# Altium project LVBackplane.PrjPcb
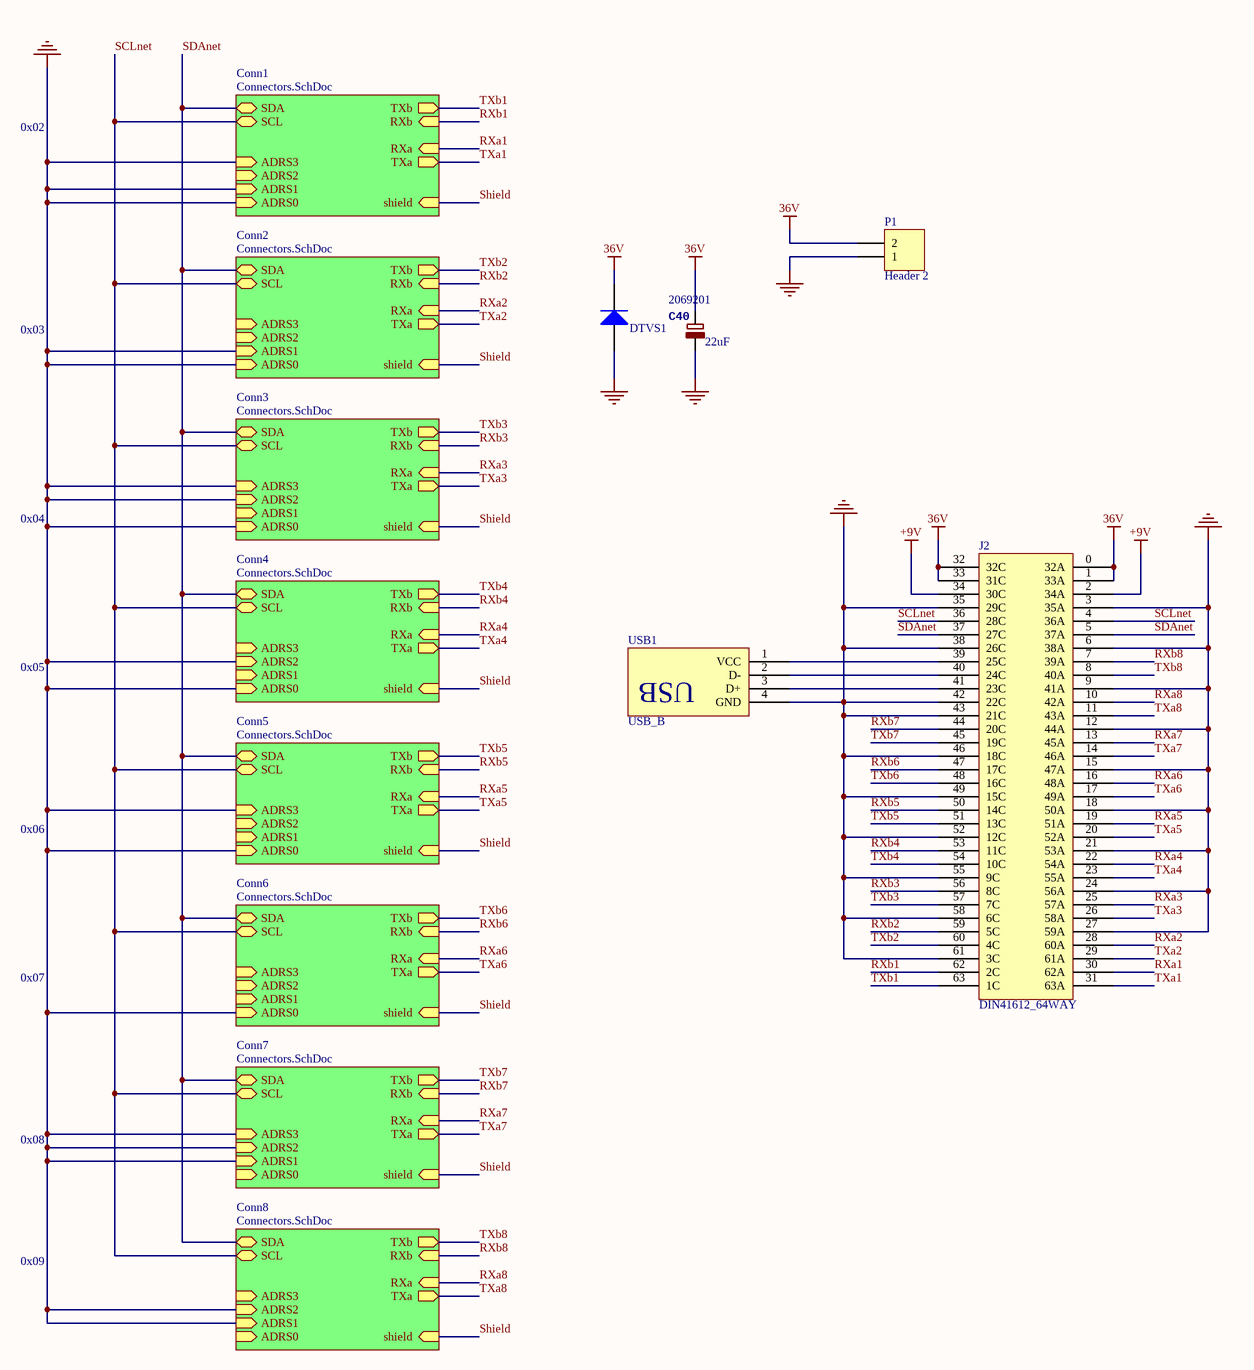
[diagram p0: Backplane.SchDoc]
2 sheets, 45 parts. Net scope: hierarchical (ports join the sheet entries above them; power ports are global).
Board files: 6C-2L-1550um.PcbDoc, Backplane.PcbDoc
Sheets:
  Backplane.SchDoc
    Conn1 = Connectors.SchDoc
    Conn2 = Connectors.SchDoc
    Conn3 = Connectors.SchDoc
    Conn4 = Connectors.SchDoc
    Conn5 = Connectors.SchDoc
    Conn6 = Connectors.SchDoc
    Conn7 = Connectors.SchDoc
    Conn8 = Connectors.SchDoc

## Sheet Backplane.SchDoc
size A3

### Parts
C40  value 22uF  Supplier Part Number 1: 2069201  [PANASONIC_D]
DTVS1  SMBJ36A  [SMBJ]  (value not drawn)
J2  DIN41612_64WAY  [09 03 164 6919]
P1  Header 2  [8PCV]
USB1  USB_B  [USB_B_VERTICAL]

### Sub-sheets
Conn1 = Connectors.SchDoc: SDA (bidir), SCL (bidir), RXb (in), TXb (out), RXa (in), TXa (out), ADRS3 (in), ADRS2 (in), ADRS1 (in), ADRS0 (in), shield (in)
Conn2 = Connectors.SchDoc: SDA (bidir), SCL (bidir), RXb (in), TXb (out), RXa (in), TXa (out), ADRS3 (in), ADRS2 (in), ADRS1 (in), ADRS0 (in), shield (in)
Conn3 = Connectors.SchDoc: SDA (bidir), SCL (bidir), RXb (in), TXb (out), RXa (in), TXa (out), ADRS3 (in), ADRS2 (in), ADRS1 (in), ADRS0 (in), shield (in)
Conn4 = Connectors.SchDoc: SDA (bidir), SCL (bidir), RXb (in), TXb (out), RXa (in), TXa (out), ADRS3 (in), ADRS2 (in), ADRS1 (in), ADRS0 (in), shield (in)
Conn5 = Connectors.SchDoc: SDA (bidir), SCL (bidir), RXb (in), TXb (out), RXa (in), TXa (out), ADRS3 (in), ADRS2 (in), ADRS1 (in), ADRS0 (in), shield (in)
Conn6 = Connectors.SchDoc: SDA (bidir), SCL (bidir), RXb (in), TXb (out), RXa (in), TXa (out), ADRS3 (in), ADRS2 (in), ADRS1 (in), ADRS0 (in), shield (in)
Conn7 = Connectors.SchDoc: SDA (bidir), SCL (bidir), RXb (in), TXb (out), RXa (in), TXa (out), ADRS3 (in), ADRS2 (in), ADRS1 (in), ADRS0 (in), shield (in)
Conn8 = Connectors.SchDoc: SDA (bidir), SCL (bidir), RXb (in), TXb (out), RXa (in), TXa (out), ADRS3 (in), ADRS2 (in), ADRS1 (in), ADRS0 (in), shield (in)

### Nets
36V: C40.1 DTVS1.1(K) J2.0(32A) J2.1(33A) J2.32(32C) J2.33(31C) P1.2
+9V: J2.2(34A) J2.34(30C)
GND: C40.2 DTVS1.2(A) J2.3(35A) J2.6(38A) J2.9(41A) J2.12(44A) J2.15(47A) J2.18(50A) J2.21(53A) J2.24(56A) J2.27(59A) J2.35(29C) J2.38(26C) J2.42(22C) J2.43(21C) J2.46(18C) J2.49(15C) J2.52(12C) J2.55(9C) J2.58(6C) J2.61(3C) P1.1 USB1.4(GND) ; sheet Conn1/ADRS3, sheet Conn1/ADRS1, sheet Conn1/ADRS0, sheet Conn2/ADRS1, sheet Conn2/ADRS0, sheet Conn3/ADRS3, sheet Conn3/ADRS2, sheet Conn3/ADRS0, sheet Conn4/ADRS2, sheet Conn4/ADRS0, sheet Conn5/ADRS3, sheet Conn5/ADRS0, sheet Conn6/ADRS0, sheet Conn7/ADRS3, sheet Conn7/ADRS2, sheet Conn7/ADRS1, sheet Conn8/ADRS2, sheet Conn8/ADRS1
RXa1: J2.30(62A) ; sheet Conn1/RXa
RXa2: J2.28(60A) ; sheet Conn2/RXa
RXa3: J2.25(57A) ; sheet Conn3/RXa
RXa4: J2.22(54A) ; sheet Conn4/RXa
RXa5: J2.19(51A) ; sheet Conn5/RXa
RXa6: J2.16(48A) ; sheet Conn6/RXa
RXa7: J2.13(45A) ; sheet Conn7/RXa
RXa8: J2.10(42A) ; sheet Conn8/RXa
RXb1: J2.62(2C) ; sheet Conn1/RXb
RXb2: J2.59(5C) ; sheet Conn2/RXb
RXb3: J2.56(8C) ; sheet Conn3/RXb
RXb4: J2.53(11C) ; sheet Conn4/RXb
RXb5: J2.50(14C) ; sheet Conn5/RXb
RXb6: J2.47(17C) ; sheet Conn6/RXb
RXb7: J2.44(20C) ; sheet Conn7/RXb
RXb8: J2.7(39A) ; sheet Conn8/RXb
SCLnet: J2.4(36A) J2.36(28C) ; sheet Conn1/SCL, sheet Conn2/SCL, sheet Conn3/SCL, sheet Conn4/SCL, sheet Conn5/SCL, sheet Conn6/SCL, sheet Conn7/SCL, sheet Conn8/SCL
SDAnet: J2.5(37A) J2.37(27C) ; sheet Conn1/SDA, sheet Conn2/SDA, sheet Conn3/SDA, sheet Conn4/SDA, sheet Conn5/SDA, sheet Conn6/SDA, sheet Conn7/SDA, sheet Conn8/SDA
Shield: sheet Conn1/shield, sheet Conn2/shield, sheet Conn3/shield, sheet Conn4/shield, sheet Conn5/shield, sheet Conn6/shield, sheet Conn7/shield, sheet Conn8/shield
TXa1: J2.31(63A) ; sheet Conn1/TXa
TXa2: J2.29(61A) ; sheet Conn2/TXa
TXa3: J2.26(58A) ; sheet Conn3/TXa
TXa4: J2.23(55A) ; sheet Conn4/TXa
TXa5: J2.20(52A) ; sheet Conn5/TXa
TXa6: J2.17(49A) ; sheet Conn6/TXa
TXa7: J2.14(46A) ; sheet Conn7/TXa
TXa8: J2.11(43A) ; sheet Conn8/TXa
TXb1: J2.63(1C) ; sheet Conn1/TXb
TXb2: J2.60(4C) ; sheet Conn2/TXb
TXb3: J2.57(7C) ; sheet Conn3/TXb
TXb4: J2.54(10C) ; sheet Conn4/TXb
TXb5: J2.51(13C) ; sheet Conn5/TXb
TXb6: J2.48(16C) ; sheet Conn6/TXb
TXb7: J2.45(19C) ; sheet Conn7/TXb
TXb8: J2.8(40A) ; sheet Conn8/TXb
NetJ2_39: J2.39(25C) USB1.1(VCC)
NetJ2_40: J2.40(24C) USB1.2(D-)
NetJ2_41: J2.41(23C) USB1.3(D+)

### Notes on the sheet
- 0x02
- 0x03
- 0x04
- 0x05
- 0x06
- 0x07
- 0x08
- 0x09
- (in symbol USB_B) USB

### Library data of the parts
C40 = CPOL-EUD: PartNo: EMZA500ADA220MF61G; Supplier 1: Farnell
DTVS1 = SMBJ: TVS; Note: Pin 2 is not connected and not drawn.; Published: 21-Mar-2003; LatestRevisionDate: 29-May-2009; LatestRevisionNote: IPC-7351 Footprint Added.; DatasheetVersion: Oct-1999; PackageVersion: Sep-2001; PackageReference: SOT-23; Publisher: Altium Limited; PackageDescription: 3-Pin SOT-23 Package 0.95 mm Pitch, 2.5 mm Lead Span; ComponentLink1Description: Manufacturer Link; ComponentLink1URL: http://www.infineon.com/; ComponentLink2Description: Datasheet; ComponentLink2URL: http://www.infineon.com/upload/Document/cmc_upload/documents/080/656/bas116series.pdf; PartNo: SMBJ36A
J2 = DIN41612_64WAY: PartNo: 9-1393640-3
P1 = Header 2: Header, 2-Pin; PartNo: 8PCV-02-006; LatestRevisionDate: 17-Jul-2002; LatestRevisionNote: Re-released for DXP Platform.; Publisher: Altium Limited

## Sheet Connectors.SchDoc
size A4
Used 8 times, as channels Conn1, Conn2, Conn3, Conn4, Conn5, Conn6, Conn7, Conn8. Parts and nets are listed once, with the designators drawn on the sheet.
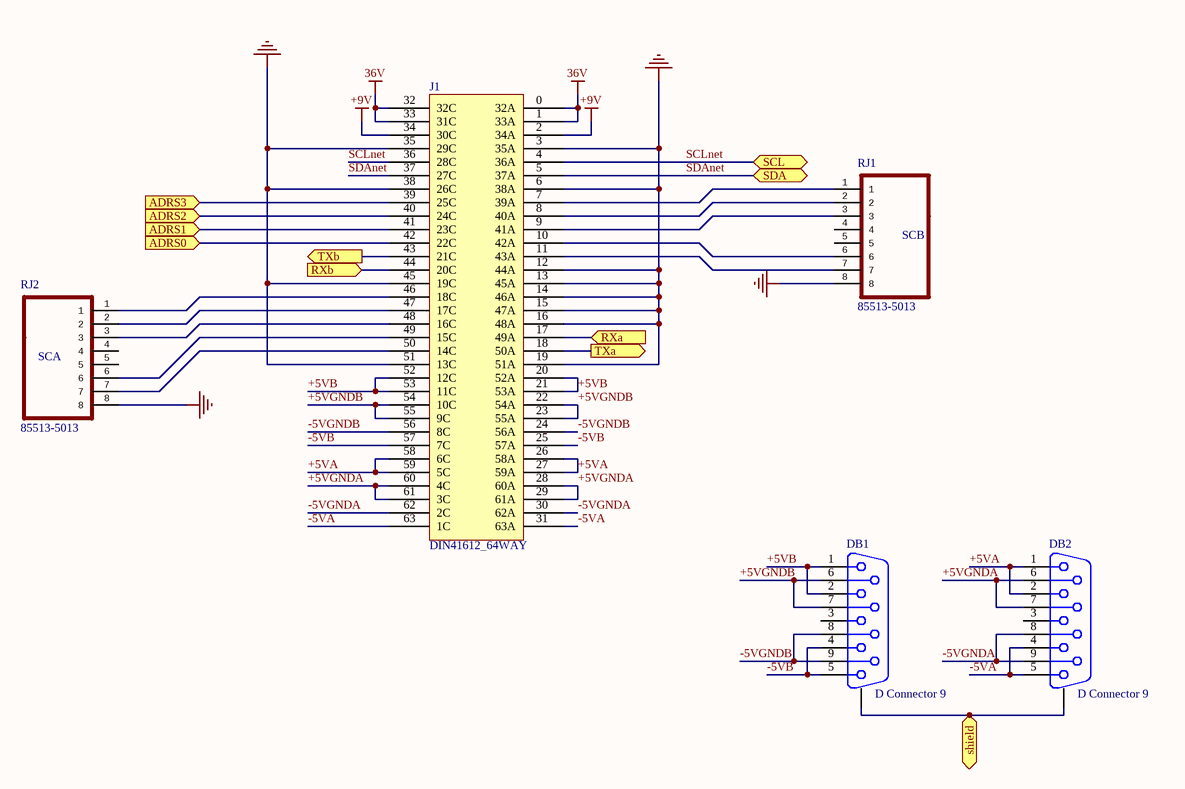
[diagram p1: Connectors.SchDoc]

### Parts
DB1  D Connector 9  [DSUB1.STRAIGHT]
DB2  D Connector 9  [DSUB1.STRAIGHT]
J1  DIN41612_64WAY  [09 03 164 6919]
RJ1  85513-5013  [RJ45_SMD_VERT]
RJ2  85513-5013  [RJ45_SMD_VERT]

### Ports
ADRS0 (in), ADRS1 (in), ADRS2 (in), ADRS3 (in), RXa (in), RXb (in), SCL (bidir), SDA (bidir), shield (in), TXa (out), TXb (out)

### Nets
36V: J1.0(32A) J1.1(33A) J1.32(32C) J1.33(31C)
+9V: J1.2(34A) J1.34(30C)
GND: J1.3(35A) J1.6(38A) J1.12(44A) J1.13(45A) J1.14(46A) J1.15(47A) J1.16(48A) J1.19(51A) J1.35(29C) J1.38(26C) J1.45(19C) J1.51(13C) RJ1.8 RJ2.8
+5VA: DB2.1 DB2.2 J1.26(58A) J1.27(59A) J1.58(6C) J1.59(5C)
+5VB: DB1.1 DB1.2 J1.20(52A) J1.21(53A) J1.52(12C) J1.53(11C)
+5VGNDA: DB2.6 DB2.7 J1.28(60A) J1.29(61A) J1.60(4C) J1.61(3C)
+5VGNDB: DB1.6 DB1.7 J1.22(54A) J1.23(55A) J1.54(10C) J1.55(9C)
-5VA: DB2.4 DB2.5 J1.31(63A) J1.63(1C)
-5VB: DB1.4 DB1.5 J1.25(57A) J1.57(7C)
-5VGNDA: DB2.8 DB2.9 J1.30(62A) J1.62(2C)
-5VGNDB: DB1.8 DB1.9 J1.24(56A) J1.56(8C)
ADRS0: J1.42(22C) ; port ADRS0
ADRS1: J1.41(23C) ; port ADRS1
ADRS2: J1.40(24C) ; port ADRS2
ADRS3: J1.39(25C) ; port ADRS3
RXa: J1.17(49A) ; port RXa
RXb: J1.44(20C) ; port RXb
SCLnet: J1.4(36A) J1.36(28C) ; port SCL
SDAnet: J1.5(37A) J1.37(27C) ; port SDA
shield: DB1.0 DB2.0 ; port shield
TXa: J1.18(50A) ; port TXa
TXb: J1.43(21C) ; port TXb
NetJ1_7: J1.7(39A) RJ1.1
NetJ1_8: J1.8(40A) RJ1.2
NetJ1_9: J1.9(41A) RJ1.3
NetJ1_10: J1.10(42A) RJ1.6
NetJ1_11: J1.11(43A) RJ1.7
NetJ1_46: J1.46(18C) RJ2.1
NetJ1_47: J1.47(17C) RJ2.2
NetJ1_48: J1.48(16C) RJ2.3
NetJ1_49: J1.49(15C) RJ2.6
NetJ1_50: J1.50(14C) RJ2.7

Not connected (* = marked no-connect by the designer): DB1 3; DB2 3; RJ1 4 5; RJ2 4 5

### Channels
Conn1: designators end in _Conn1; ports ADRS0=GND ADRS1=GND ADRS2=NetJ1_Conn1_40 ADRS3=GND RXa=RXa1 RXb=RXb1 SCL=SCLnet SDA=SDAnet shield=Shield TXa=TXa1 TXb=TXb1
Conn2: designators end in _Conn2; ports ADRS0=GND ADRS1=GND ADRS2=NetJ1_Conn2_40 ADRS3=NetJ1_Conn2_39 RXa=RXa2 RXb=RXb2 SCL=SCLnet SDA=SDAnet shield=Shield TXa=TXa2 TXb=TXb2
Conn3: designators end in _Conn3; ports ADRS0=GND ADRS1=NetJ1_Conn3_41 ADRS2=GND ADRS3=GND RXa=RXa3 RXb=RXb3 SCL=SCLnet SDA=SDAnet shield=Shield TXa=TXa3 TXb=TXb3
Conn4: designators end in _Conn4; ports ADRS0=GND ADRS1=NetJ1_Conn4_41 ADRS2=GND ADRS3=NetJ1_Conn4_39 RXa=RXa4 RXb=RXb4 SCL=SCLnet SDA=SDAnet shield=Shield TXa=TXa4 TXb=TXb4
Conn5: designators end in _Conn5; ports ADRS0=GND ADRS1=NetJ1_Conn5_41 ADRS2=NetJ1_Conn5_40 ADRS3=GND RXa=RXa5 RXb=RXb5 SCL=SCLnet SDA=SDAnet shield=Shield TXa=TXa5 TXb=TXb5
Conn6: designators end in _Conn6; ports ADRS0=GND ADRS1=NetJ1_Conn6_41 ADRS2=NetJ1_Conn6_40 ADRS3=NetJ1_Conn6_39 RXa=RXa6 RXb=RXb6 SCL=SCLnet SDA=SDAnet shield=Shield TXa=TXa6 TXb=TXb6
Conn7: designators end in _Conn7; ports ADRS0=NetJ1_Conn7_42 ADRS1=GND ADRS2=GND ADRS3=GND RXa=RXa7 RXb=RXb7 SCL=SCLnet SDA=SDAnet shield=Shield TXa=TXa7 TXb=TXb7
Conn8: designators end in _Conn8; ports ADRS0=NetJ1_Conn8_42 ADRS1=GND ADRS2=GND ADRS3=NetJ1_Conn8_39 RXa=RXa8 RXb=RXb8 SCL=SCLnet SDA=SDAnet shield=Shield TXa=TXa8 TXb=TXb8

### Notes on the sheet
- (near RJ1) SCB
- (near RJ2) SCA

### Library data of the parts
DB1 DB2 = D Connector 9: Receptacle Assembly, 9 Position, Right Angle; PartNo: L177TSEH09SOL2RM8; PackageDocument: O; Positions: 9; Published: 15-Jun-2001; LatestRevisionDate: 17-Jul-2002; LatestRevisionNote: Re-released for DXP Platform.; DatasheetDocument: 1-Sep-1999; PackageReference: 788750; Publisher: Altium Limited; Orientation: Right Angle; Gender: Receptacle
J1 = DIN41612_64WAY: PartNo: 9-1393640-3
RJ1 RJ2 = 85513-5013: MPN: 85513-5013; PACKAGE: RJ45, JACK, 8P8C; SUPPLIER: MOLEX; PartNo: 85513-5013

## Nets that join several sheets
36V: Backplane (7 pins), Conn1 (J1_Conn1.0 J1_Conn1.1 J1_Conn1.32 J1_Conn1.33), Conn2 (J1_Conn2.0 J1_Conn2.1 J1_Conn2.32 J1_Conn2.33), Conn3 (J1_Conn3.0 J1_Conn3.1 J1_Conn3.32 J1_Conn3.33), Conn4 (J1_Conn4.0 J1_Conn4.1 J1_Conn4.32 J1_Conn4.33), Conn5 (J1_Conn5.0 J1_Conn5.1 J1_Conn5.32 J1_Conn5.33), Conn6 (J1_Conn6.0 J1_Conn6.1 J1_Conn6.32 J1_Conn6.33), Conn7 (J1_Conn7.0 J1_Conn7.1 J1_Conn7.32 J1_Conn7.33), Conn8 (J1_Conn8.0 J1_Conn8.1 J1_Conn8.32 J1_Conn8.33)
+9V: Backplane (J2.2 J2.34), Conn1 (J1_Conn1.2 J1_Conn1.34), Conn2 (J1_Conn2.2 J1_Conn2.34), Conn3 (J1_Conn3.2 J1_Conn3.34), Conn4 (J1_Conn4.2 J1_Conn4.34), Conn5 (J1_Conn5.2 J1_Conn5.34), Conn6 (J1_Conn6.2 J1_Conn6.34), Conn7 (J1_Conn7.2 J1_Conn7.34), Conn8 (J1_Conn8.2 J1_Conn8.34)
GND: Backplane (23 pins), Conn1 (17 pins), Conn2 (16 pins), Conn3 (17 pins), Conn4 (16 pins), Conn5 (16 pins), Conn6 (15 pins), Conn7 (17 pins), Conn8 (16 pins)
RXa1: Backplane (J2.30), Conn1 (J1_Conn1.17)
RXa2: Backplane (J2.28), Conn2 (J1_Conn2.17)
RXa3: Backplane (J2.25), Conn3 (J1_Conn3.17)
RXa4: Backplane (J2.22), Conn4 (J1_Conn4.17)
RXa5: Backplane (J2.19), Conn5 (J1_Conn5.17)
RXa6: Backplane (J2.16), Conn6 (J1_Conn6.17)
RXa7: Backplane (J2.13), Conn7 (J1_Conn7.17)
RXa8: Backplane (J2.10), Conn8 (J1_Conn8.17)
RXb1: Backplane (J2.62), Conn1 (J1_Conn1.44)
RXb2: Backplane (J2.59), Conn2 (J1_Conn2.44)
RXb3: Backplane (J2.56), Conn3 (J1_Conn3.44)
RXb4: Backplane (J2.53), Conn4 (J1_Conn4.44)
RXb5: Backplane (J2.50), Conn5 (J1_Conn5.44)
RXb6: Backplane (J2.47), Conn6 (J1_Conn6.44)
RXb7: Backplane (J2.44), Conn7 (J1_Conn7.44)
RXb8: Backplane (J2.7), Conn8 (J1_Conn8.44)
SCLnet: Backplane (J2.4 J2.36), Conn1 (J1_Conn1.4 J1_Conn1.36), Conn2 (J1_Conn2.4 J1_Conn2.36), Conn3 (J1_Conn3.4 J1_Conn3.36), Conn4 (J1_Conn4.4 J1_Conn4.36), Conn5 (J1_Conn5.4 J1_Conn5.36), Conn6 (J1_Conn6.4 J1_Conn6.36), Conn7 (J1_Conn7.4 J1_Conn7.36), Conn8 (J1_Conn8.4 J1_Conn8.36)
SDAnet: Backplane (J2.5 J2.37), Conn1 (J1_Conn1.5 J1_Conn1.37), Conn2 (J1_Conn2.5 J1_Conn2.37), Conn3 (J1_Conn3.5 J1_Conn3.37), Conn4 (J1_Conn4.5 J1_Conn4.37), Conn5 (J1_Conn5.5 J1_Conn5.37), Conn6 (J1_Conn6.5 J1_Conn6.37), Conn7 (J1_Conn7.5 J1_Conn7.37), Conn8 (J1_Conn8.5 J1_Conn8.37)
Shield: Conn1 (DB1_Conn1.0 DB2_Conn1.0), Conn2 (DB1_Conn2.0 DB2_Conn2.0), Conn3 (DB1_Conn3.0 DB2_Conn3.0), Conn4 (DB1_Conn4.0 DB2_Conn4.0), Conn5 (DB1_Conn5.0 DB2_Conn5.0), Conn6 (DB1_Conn6.0 DB2_Conn6.0), Conn7 (DB1_Conn7.0 DB2_Conn7.0), Conn8 (DB1_Conn8.0 DB2_Conn8.0)
TXa1: Backplane (J2.31), Conn1 (J1_Conn1.18)
TXa2: Backplane (J2.29), Conn2 (J1_Conn2.18)
TXa3: Backplane (J2.26), Conn3 (J1_Conn3.18)
TXa4: Backplane (J2.23), Conn4 (J1_Conn4.18)
TXa5: Backplane (J2.20), Conn5 (J1_Conn5.18)
TXa6: Backplane (J2.17), Conn6 (J1_Conn6.18)
TXa7: Backplane (J2.14), Conn7 (J1_Conn7.18)
TXa8: Backplane (J2.11), Conn8 (J1_Conn8.18)
TXb1: Backplane (J2.63), Conn1 (J1_Conn1.43)
TXb2: Backplane (J2.60), Conn2 (J1_Conn2.43)
TXb3: Backplane (J2.57), Conn3 (J1_Conn3.43)
TXb4: Backplane (J2.54), Conn4 (J1_Conn4.43)
TXb5: Backplane (J2.51), Conn5 (J1_Conn5.43)
TXb6: Backplane (J2.48), Conn6 (J1_Conn6.43)
TXb7: Backplane (J2.45), Conn7 (J1_Conn7.43)
TXb8: Backplane (J2.8), Conn8 (J1_Conn8.43)